# EasyEDA schematic schematic.json
TITLE: Sheet_1; REV: 1.0; Date: 2023-12-08; Sheet: 1/1; Drawn By: David La; Company: Your Company
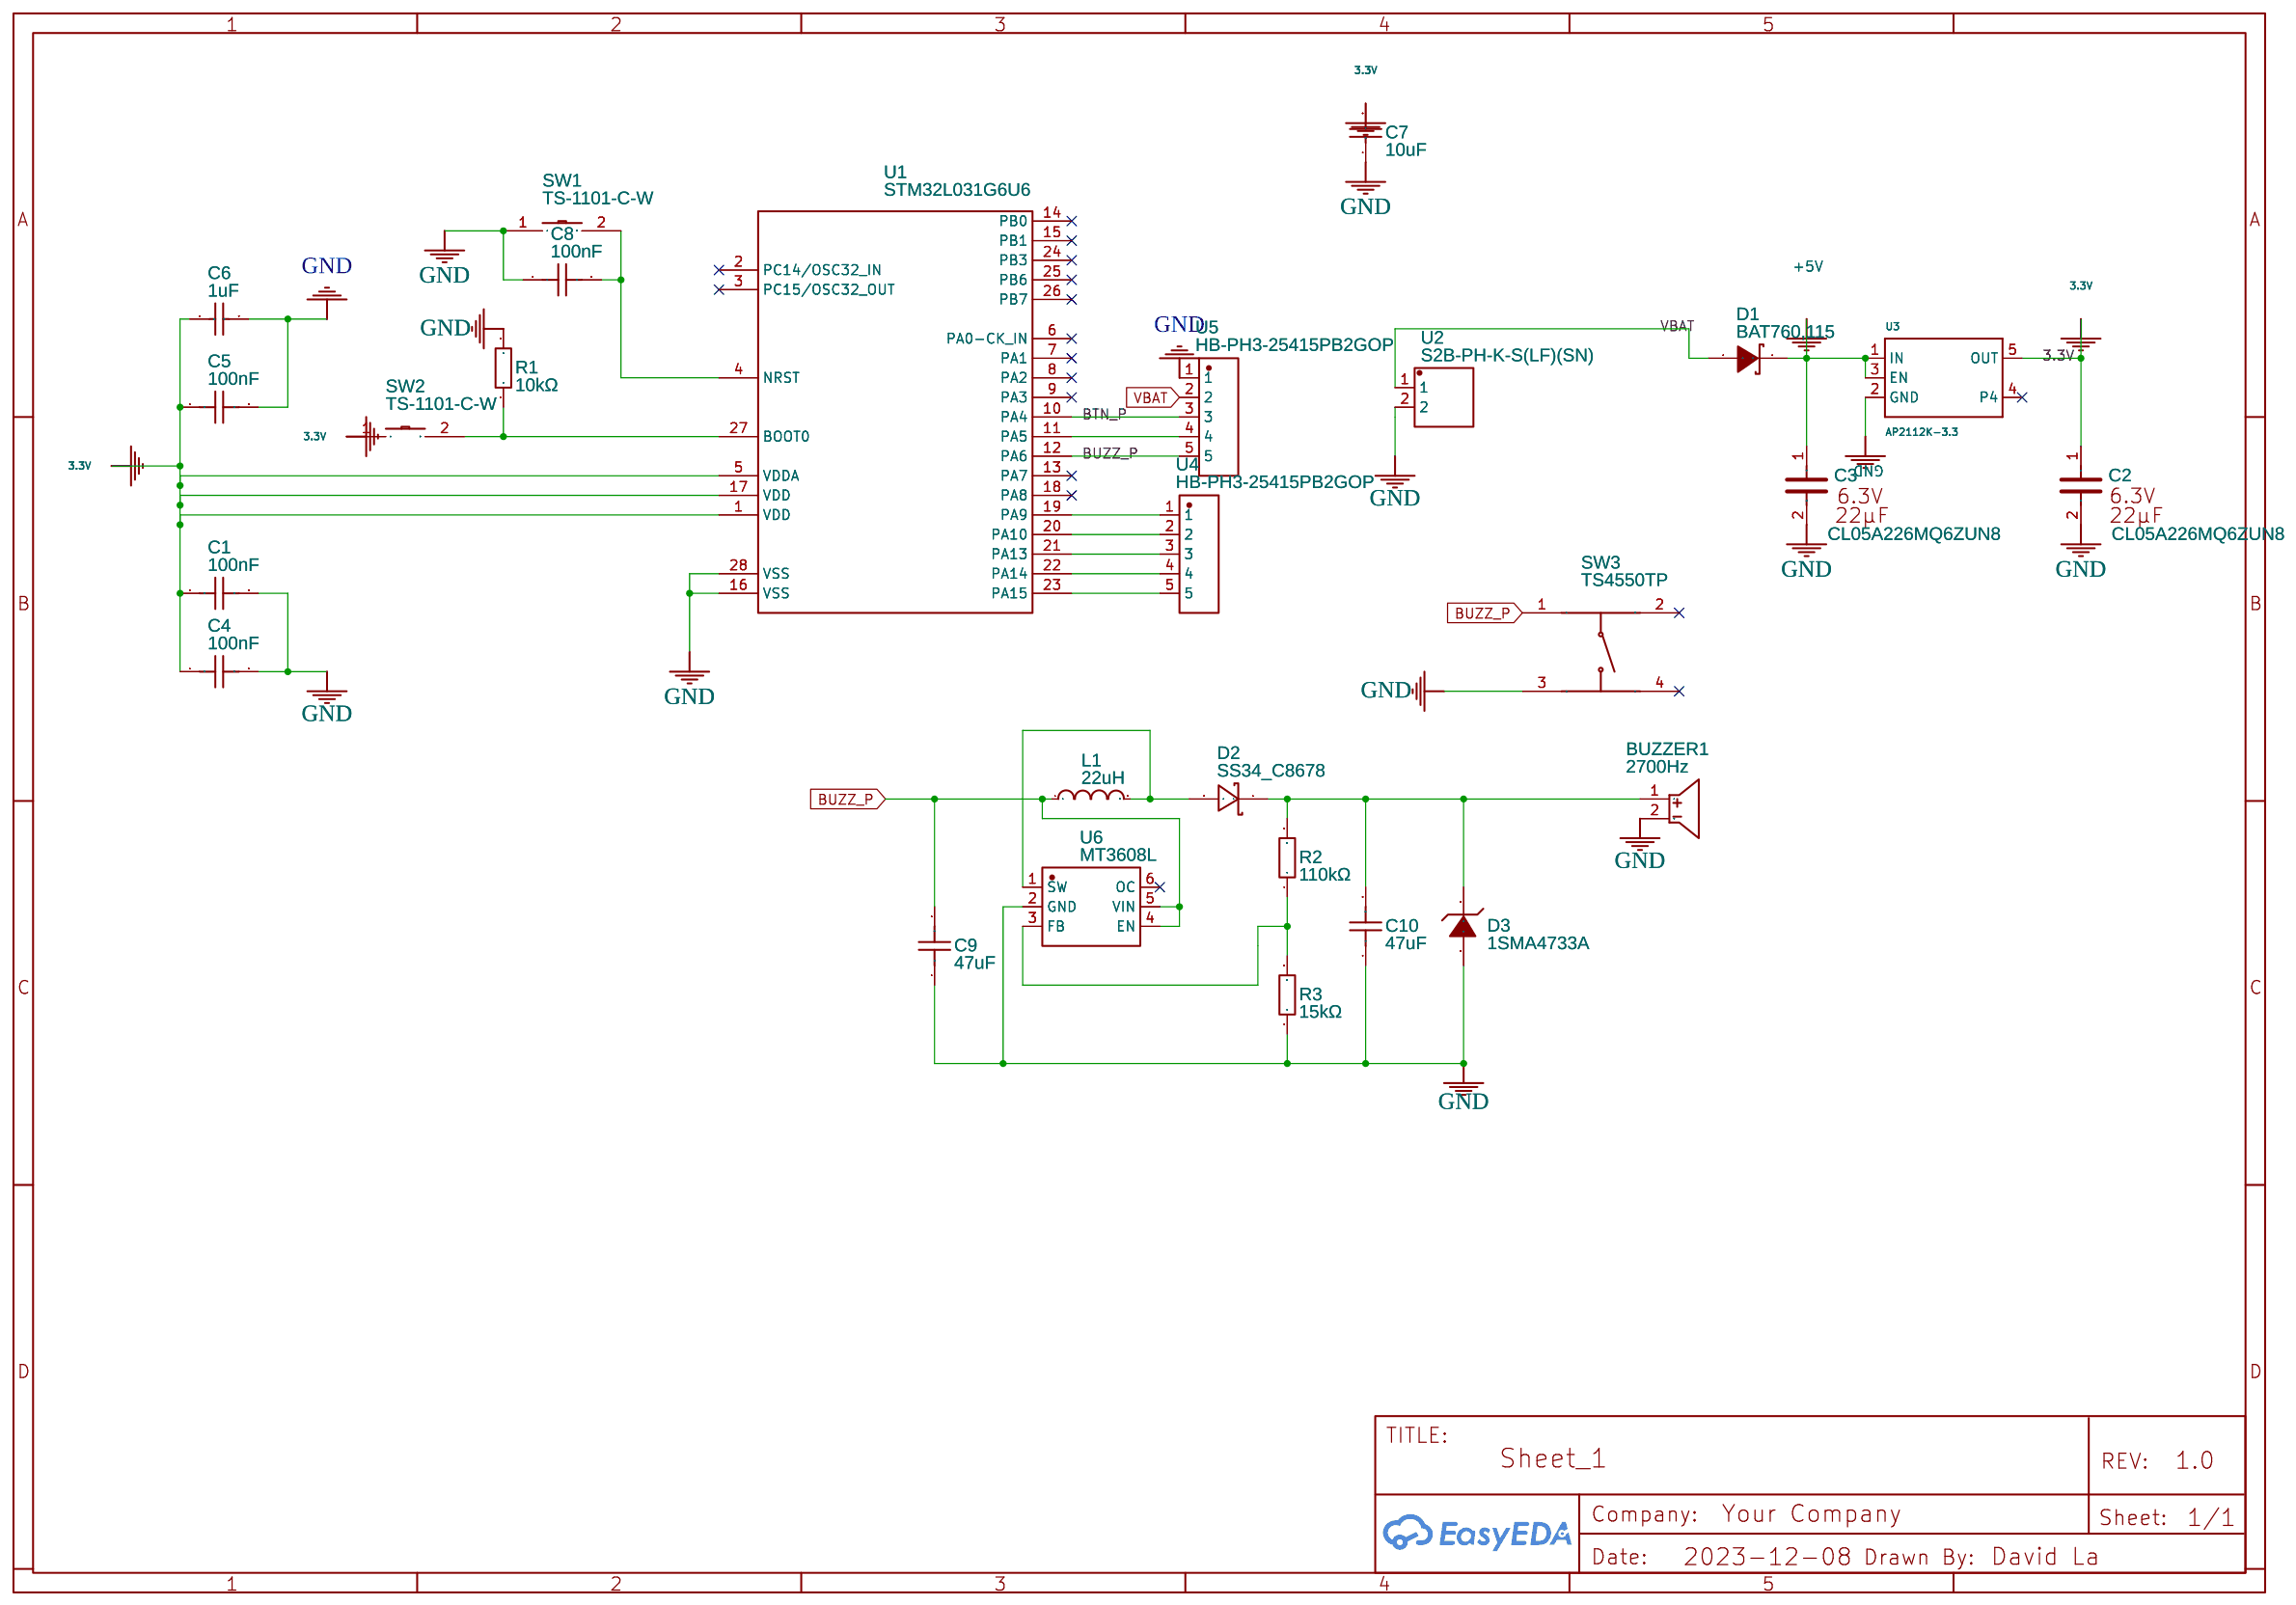
[diagram p0: schematic sheet]

## Parts
BUZZER1  2700Hz  [BUZ-TH_BD23.0-P15.00-D0.8-FD]
C1  100nF  [C0402]
C2  CL05A226MQ6ZUN8  [SAMSUNG_CL05A226MQ6ZUN8_0]
C3  CL05A226MQ6ZUN8  [SAMSUNG_CL05A226MQ6ZUN8_0]
C4  100nF  [C0402]
C5  100nF  [C0402]
C6  1uF  [C0402]
C7  10uF  [C0402]
C8  100nF  [C0402]
C9  47uF  [C0603]
C10  47uF  [C0603]
D1  BAT760,115  [SOD-323_L1.7-W1.3-LS2.5-RD]
D2  SS34_C8678  [SMA_L4.3-W2.6-LS5.2-RD]
D3  1SMA4733A  [SMA_L4.4-W2.6-LS5.0-RD]
L1  22uH  [IND-SMD_L12.3-W12.3_SMDRI127]
R1  10kΩ  [R0402]
R2  110kΩ  [R0402]
R3  15kΩ  [R0402]
SW1  TS-1101-C-W  [SW-SMD_L6.0-W3.3-LS8.0]
SW2  TS-1101-C-W  [SW-SMD_L6.0-W3.3-LS8.0]
SW3  TS4550TP  [SW-SMD_4P-L4.5-W4.5-P3.00-LS7.0]
U1  STM32L031G6U6  [UFQFPN-28_L4.0-W4.0-P0.50-BL]
U2  S2B-PH-K-S(LF)(SN)  [CONN-TH_S2B-PH-K-S-LF-SN]
U3  AP2112K-3.3  [SOT23-5]
U4  HB-PH3-25415PB2GOP  [HDR-TH_5P-P2.54-V-M]
U5  HB-PH3-25415PB2GOP  [HDR-TH_5P-P2.54-V-M]
U6  MT3608L  [SOT-23-6_L2.9-W1.7-P0.95-LS2.8-BL]

## Library data of the parts
BUZZER1 = GPC2316YB-5V: Contributor: LCSC; Supplier: LCSC; Supplier Part: C252964; Manufacturer: INGHAi(赢海); JLCPCB Part Class: Extended Part; link: https://lcsc.com/eda_search?q=C252964&%26type=1&ref=editor
C1 C4 C5 C8 = TCC0402X5R104M250AT: Contributor: LCSC; Supplier: LCSC; Supplier Part: C359190; Manufacturer: CCTC(三环); JLCPCB Part Class: Extended Part; link: https://lcsc.com/eda_search?q=C359190&%26type=1&ref=editor
C2 C3 = SAMSUNG_CL05A226MQ6ZUN8SAMSUNG_CL05A226MQ6ZUN8_0_0: Contributor: klockvin; Manufacturer Part: GRM155R60J226ME11D; Package Display: No; Supplier: LCSC; Supplier Part: C415703; Manufacturer: muRata(村田)
C6 = CL05A105KP5NNNC: Supplier: LCSC; Manufacturer: SAMSUNG(三星); Supplier Part: C14445; JLCPCB Part Class: Extended Part; link: https://lcsc.com/eda_search?q=C14445&%26type=1&ref=editor
C7 = CL05A106MQ5NUNC: Supplier: LCSC; Manufacturer: SAMSUNG(三星); Supplier Part: C15525; JLCPCB Part Class: Basic Part; link: https://lcsc.com/eda_search?q=C15525&%26type=1&ref=editor
C9 C10 = CL10A476MQ8QRNC: Contributor: LCSC; Supplier: LCSC; Supplier Part: C16780; Manufacturer: SAMSUNG(三星); Manufacturer Part: CL21A476MQYNNNE; JLCPCB Part Class: Extended Part
D1 = BAT760,115: Contributor: LCSC; Supplier: LCSC; Supplier Part: C117941; Manufacturer: Nexperia(安世); JLCPCB Part Class: Extended Part
D2 = SS34_C8678: Supplier: LCSC; Manufacturer Part: SS34; Manufacturer: MDD; Supplier Part: C8678; JLCPCB Part Class: Basic Part
D3 = 1SMA4733A: Contributor: LCSC; Supplier: LCSC; Supplier Part: C173487; Manufacturer: MDD; JLCPCB Part Class: Extended Part
L1 = SMDRI127-220MT: Supplier: LCSC; Manufacturer: SXN(顺翔诺); Supplier Part: C9905; JLCPCB Part Class: Extended Part
R1 = RC0402JR-0710KL: Supplier: LCSC; Manufacturer: YAGEO(国巨); Supplier Part: C60489; JLCPCB Part Class: Extended Part; link: https://lcsc.com/eda_search?q=C60489&%26type=1&ref=editor
R2 = RC0402FR-07110KL: Supplier: LCSC; Manufacturer: YAGEO(国巨); Supplier Part: C138065; JLCPCB Part Class: Extended Part
R3 = RC0402FR-0715KL: Supplier: LCSC; Manufacturer: YAGEO(国巨); Supplier Part: C114761; JLCPCB Part Class: Extended Part
SW1 SW2 = TS-1101-C-W: Contributor: LCSC; Supplier: LCSC; Supplier Part: C318938; Manufacturer: XKB Connectivity(中国星坤); JLCPCB Part Class: Extended Part; link: https://lcsc.com/eda_search?q=C318938&%26type=1&ref=editor
SW3 = TS4550TP: Contributor: LCSC; Supplier: LCSC; Supplier Part: C412373; Manufacturer: SHOU HAN(首韩); JLCPCB Part Class: Extended Part
U1 = STM32L031G6U6: Voltage - Supply: 1.8V ~ 3.6V; Contributor: LCSC; Supplier: LCSC; Manufacturer: ST(意法半导体); Supplier Part: C96514; JLCPCB Part Class: Extended Part; link: https://lcsc.com/eda_search?q=C96514&%26type=1&ref=editor
U2 = S2B-PH-K-S(LF)(SN): Contributor: 立创EDA官方封装库; Supplier: LCSC; Supplier Part: C173752; Manufacturer: JST; JLCPCB Part Class: Extended Part; link: https://lcsc.com/eda_search?q=C173752&%26type=1&ref=editor; 3DModel: CONN-TH_HR-PH2.0-WI-2P
U3 = -: Supplier: LCSC; Manufacturer: DIODES(美台); Manufacturer Part: AP2112K-3.3TRG1; Supplier Part: C51118
U4 U5 = HB-PH3-25415PB2GOP: Contributor: lcsc; Supplier: LCSC; Supplier Part: C6332198; Manufacturer: HANBO(汉博); link: https://lcsc.com/eda_search?q=C6332198&%26type=1&ref=editor
U6 = MT3608L: Contributor: LCSC; Supplier: LCSC; Supplier Part: C2932326; Manufacturer: 西安航天民芯; JLCPCB Part Class: Extended Part

## Nets
3.3V: C1.1 C2.1 C4.1 C5.1 C6.1 C7.2 SW2.1 U1.1(VDD) U1.5(VDDA) U1.17(VDD) U3.5(OUT)
+5V: C3.1 D1.1(K) U3.1(IN) U3.3(EN)
GND: BUZZER1.2 C1.2 C2.2 C3.2 C4.2 C5.2 C6.2 C7.1 C8.1 C9.1 C10.1 D3.2(A) R1.2 R3.1 SW1.1 SW3.3 U1.16(VSS) U1.28(VSS) U2.2 U3.2(GND) U5.1 U6.2(GND)
VBAT: D1.2(A) U2.1 U5.2
BTN_P: U1.10(PA4) U5.3
BUZZ_P: C9.2 L1.1 SW3.1 U1.12(PA6) U5.5 U6.4(EN) U6.5(VIN)
Net-(BUZZER1-1): BUZZER1.1 C10.2 D2.1(K) D3.1(K) R2.2
Net-(C8-2): C8.2 SW1.2 U1.4(NRST)
Net-(D2-2): D2.2(A) L1.2 U6.1(SW)
Net-(R1-1): R1.1 SW2.2 U1.27(BOOT0)
Net-(R2-1): R2.1 R3.2 U6.3(FB)
Net-(U1-11): U1.11(PA5) U5.4
Net-(U1-19): U1.19(PA9) U4.1
Net-(U1-20): U1.20(PA10) U4.2
Net-(U1-21): U1.21(PA13) U4.3
Net-(U1-22): U1.22(PA14) U4.4
Net-(U1-23): U1.23(PA15) U4.5

Not connected (* = marked no-connect by the designer): SW3 2* 4*; U1 2(PC14/OSC32_IN)* 3(PC15/OSC32_OUT)* 6(PA0-CK_IN)* 7(PA1)* 8(PA2)* 9(PA3)* 13(PA7)* 14(PB0)* 15(PB1)* 18(PA8)* 24(PB3)* 25(PB6)* 26(PB7)*; U3 4(P4)*; U6 6(OC)*
